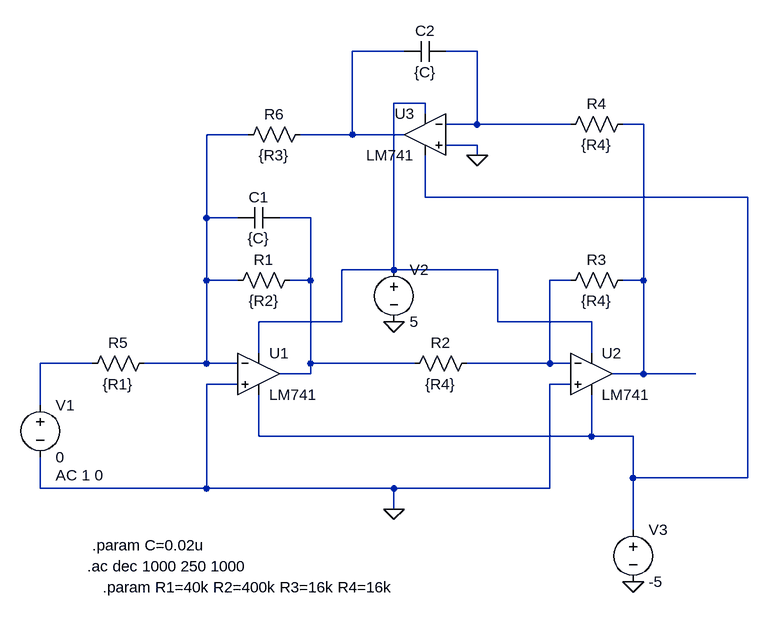
[diagram p0: schematic band_pass.asc]
band_pass.asc, the LTspice schematic file:
Version 4
SHEET 1 1012 680
WIRE 224 -400 144 -400
WIRE 336 -400 288 -400
WIRE 256 -320 208 -320
WIRE 256 -304 256 -320
WIRE 336 -288 336 -400
WIRE 336 -288 288 -288
WIRE 480 -288 336 -288
WIRE 592 -288 560 -288
WIRE -16 -272 -80 -272
WIRE 144 -272 144 -400
WIRE 144 -272 64 -272
WIRE 224 -272 144 -272
WIRE 336 -256 288 -256
WIRE 336 -240 336 -256
WIRE 256 -176 256 -240
WIRE 752 -176 256 -176
WIRE -80 -144 -80 -272
WIRE -32 -144 -80 -144
WIRE 80 -144 32 -144
WIRE 208 -64 208 -320
WIRE 208 -64 128 -64
WIRE 368 -64 208 -64
WIRE -80 -48 -80 -144
WIRE -32 -48 -80 -48
WIRE 80 -48 80 -144
WIRE 80 -48 48 -48
WIRE 480 -48 448 -48
WIRE 592 -48 592 -288
WIRE 592 -48 560 -48
WIRE 128 16 128 -64
WIRE 128 16 0 16
WIRE 368 16 368 -64
WIRE 512 16 368 16
WIRE 0 64 0 16
WIRE 512 64 512 16
WIRE -256 80 -336 80
WIRE -80 80 -80 -48
WIRE -80 80 -176 80
WIRE -32 80 -80 80
WIRE 80 80 80 -48
WIRE 240 80 80 80
WIRE 448 80 448 -48
WIRE 448 80 320 80
WIRE 480 80 448 80
WIRE 80 96 80 80
WIRE 80 96 32 96
WIRE 592 96 592 -48
WIRE 592 96 544 96
WIRE 672 96 592 96
WIRE -32 112 -80 112
WIRE 480 112 448 112
WIRE -336 144 -336 80
WIRE 0 192 0 128
WIRE 512 192 512 128
WIRE 512 192 0 192
WIRE 576 192 512 192
WIRE 576 256 576 192
WIRE 752 256 752 -176
WIRE 752 256 576 256
WIRE -336 272 -336 224
WIRE -80 272 -80 112
WIRE -80 272 -336 272
WIRE 208 272 -80 272
WIRE 448 272 448 112
WIRE 448 272 208 272
WIRE 208 304 208 272
WIRE 576 336 576 256
FLAG 336 -240 0
FLAG 208 304 0
FLAG 208 16 0
FLAG 576 416 0
SYMBOL LM741 0 32 R0
SYMATTR InstName U1
SYMBOL LM741 512 32 R0
SYMATTR InstName U2
SYMBOL LM741 256 -336 M0
SYMATTR InstName U3
SYMBOL res 64 -64 R90
WINDOW 0 0 56 VBottom 2
WINDOW 3 32 56 VTop 2
SYMATTR InstName R1
SYMATTR Value {R2}
SYMBOL res 336 64 R90
WINDOW 0 0 56 VBottom 2
WINDOW 3 32 56 VTop 2
SYMATTR InstName R2
SYMATTR Value {R4}
SYMBOL res 576 -64 R90
WINDOW 0 0 56 VBottom 2
WINDOW 3 32 56 VTop 2
SYMATTR InstName R3
SYMATTR Value {R4}
SYMBOL res 576 -304 R90
WINDOW 0 0 56 VBottom 2
WINDOW 3 32 56 VTop 2
SYMATTR InstName R4
SYMATTR Value {R4}
SYMBOL res -160 64 R90
WINDOW 0 0 56 VBottom 2
WINDOW 3 32 56 VTop 2
SYMATTR InstName R5
SYMATTR Value {R1}
SYMBOL res 80 -288 R90
WINDOW 0 0 56 VBottom 2
WINDOW 3 32 56 VTop 2
SYMATTR InstName R6
SYMATTR Value {R3}
SYMBOL cap 32 -160 R90
WINDOW 0 0 32 VBottom 2
WINDOW 3 32 32 VTop 2
SYMATTR InstName C1
SYMATTR Value {C}
SYMBOL cap 288 -416 R90
WINDOW 0 0 32 VBottom 2
WINDOW 3 32 32 VTop 2
SYMATTR InstName C2
SYMATTR Value {C}
SYMBOL voltage -336 128 R0
WINDOW 123 24 124 Left 2
WINDOW 39 0 0 Left 0
SYMATTR Value2 AC 1 0
SYMATTR InstName V1
SYMATTR Value 0
SYMBOL voltage 208 -80 R0
WINDOW 123 0 0 Left 0
WINDOW 39 0 0 Left 0
SYMATTR InstName V2
SYMATTR Value 5
SYMBOL voltage 576 320 R0
WINDOW 123 0 0 Left 0
WINDOW 39 0 0 Left 0
SYMATTR InstName V3
SYMATTR Value -5
TEXT -256 360 Left 2 !.param C=0.02u
TEXT -264 392 Left 2 !.ac dec 1000 250 1000
TEXT -240 424 Left 2 !.param R1=40k R2=400k R3=16k R4=16k

The netlist it stands for:
* band_pass.asc
XU1 0 N005 N003 N006 N007 LM741  ; pins In+ In- V+ V- OUT
XU2 0 N008 N003 N006 N004 LM741  ; pins In+ In- V+ V- OUT
XU3 0 N002 N003 N006 N001 LM741  ; pins In+ In- V+ V- OUT
R1 N007 N005 {R2}
R2 N008 N007 {R4}
R3 N004 N008 {R4}
R4 N004 N002 {R4}
R5 N005 N009 {R1}
R6 N001 N005 {R3}
C1 N007 N005 {C}
C2 N002 N001 {C}
V1 N009 0 0 AC 1 0
V2 N003 0 5
V3 N006 0 -5
.param C=0.02u
.ac dec 1000 250 1000
.param R1=40k R2=400k R3=16k R4=16k
.lib LM741.lib
.backanno
.end